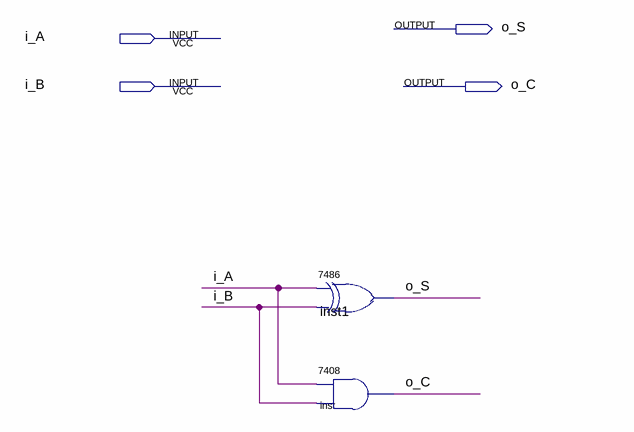
[diagram p0: schematic sheet]
// Quartus schematic half_adder.bdf as structural Verilog: 2 symbols, 4 pins
module half_adder (
  input  i_A,
  input  i_B,
  output o_S,
  output o_C
);

  \7486  inst1 (.\2 (i_A), .\3 (i_B), .\1 (o_S));
  \7408  inst (.\3 (i_B), .\2 (i_A), .\1 (o_C));
endmodule
